# Altium project FIT_TCM.PrjPcb (part 6 of 9)

## Sheet FIT_FPGA_I-J-K.SchDoc: FIT_PM12 board
size 420 x 297 mm; CheckedBy: G.Kasprowicz; Author: INR Moscow; CompanyName: WUT ISE; DrawnBy: M.Podgórski; Organization: WUT ISE; Address1: PW ISE; Address2: Nowowiejska 15/19 00-665 Warsaw; Address3: gkasprow@gmail.com; Revision: 2; SheetNumber: -; SheetTotal: -; ModifiedBy: -; CheckedDate: -; Title2: Title 2; DivGrp: WUT ISE; Designer: INR RAS; ModifiedDate: -; ProjectName: Sensor Box
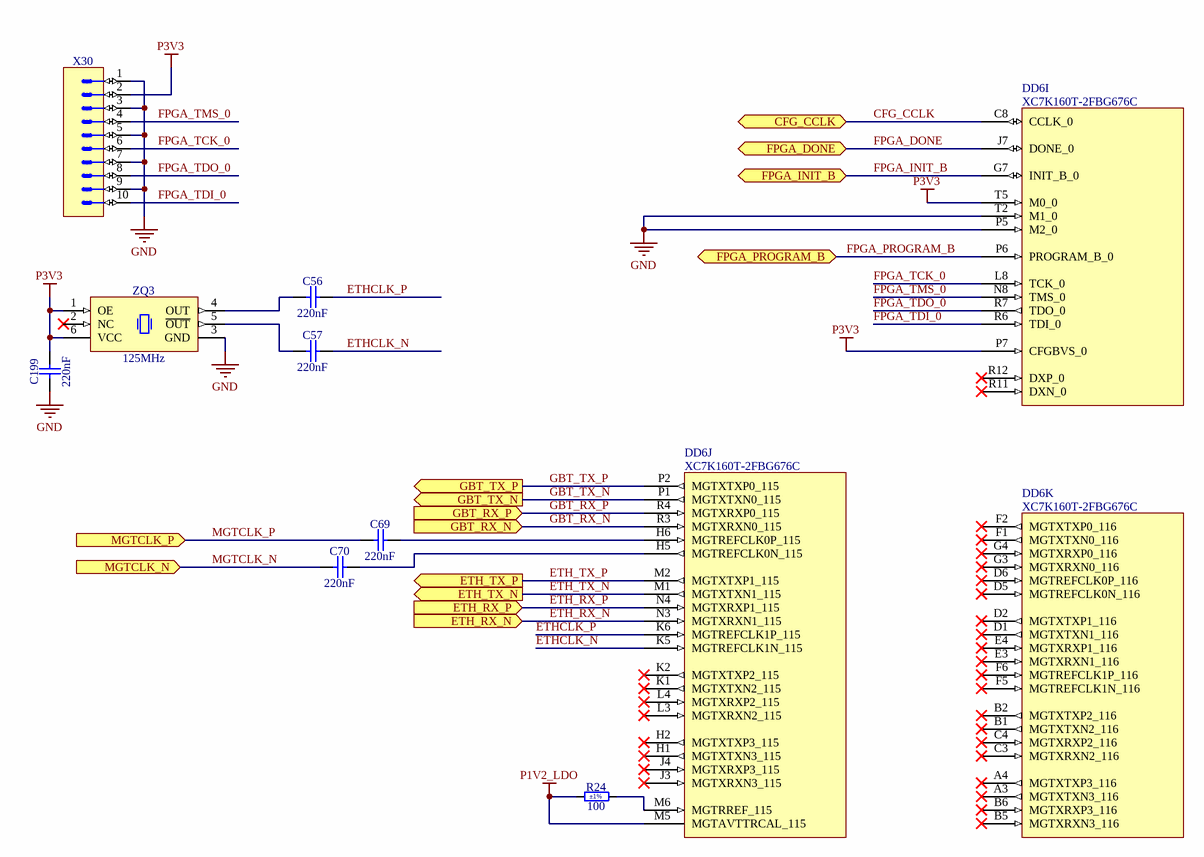
[diagram p18: FIT_FPGA_I-J-K.SchDoc]

### Parts
C56  220nF  [CAPC1608X87N]
C57  220nF  [CAPC1608X87N]
C69  220nF  [CAPC1608X87N]
C70  220nF  [CAPC1608X87N]
C199  220nF  [CAPC2012X135N]
DD6  XC7K160T-2FBG676C  [BGA676C100P26X26_2700X2700X254]  (parts I,J,K of 15)
R24  100  Tolerance: ±1%  [RESC1608X55N]
X30  (no value)  [CONNFLY_DS1014-10SF1B-B]
ZQ3  125MHz  [OSC_EPSON_SG5032VAN]

### Ports
CFG_CCLK (bidir), ETH_RX_N (in), ETH_RX_P (in), ETH_TX_N (out), ETH_TX_P (out), FPGA_DONE (bidir), FPGA_INIT_B (bidir), FPGA_PROGRAM_B (bidir), GBT_RX_N (in), GBT_RX_P (in), GBT_TX_N (out), GBT_TX_P (out), MGTCLK_N (in), MGTCLK_P (in)

### Nets
GND: C199.1 DD6.P5(M2_0) DD6.T2(M1_0) X30.1 X30.3 X30.5 X30.7 X30.9 ZQ3.3(GND)
P1V2_LDO: DD6.M5(MGTAVTTRCAL_115) R24.1
P3V3: C199.2 DD6.P7(CFGBVS_0) DD6.T5(M0_0) X30.2 ZQ3.1(OE) ZQ3.6(VCC)
CFG_CCLK: DD6.C8(CCLK_0) ; port CFG_CCLK
ETH_RX_N: DD6.N3(MGTXRXN1_115) ; port ETH_RX_N
ETH_RX_P: DD6.N4(MGTXRXP1_115) ; port ETH_RX_P
ETH_TX_N: DD6.M1(MGTXTXN1_115) ; port ETH_TX_N
ETH_TX_P: DD6.M2(MGTXTXP1_115) ; port ETH_TX_P
ETHCLK_N: C57.2 DD6.K5(MGTREFCLK1N_115)
ETHCLK_P: C56.2 DD6.K6(MGTREFCLK1P_115)
FPGA_DONE: DD6.J7(DONE_0) ; port FPGA_DONE
FPGA_INIT_B: DD6.G7(INIT_B_0) ; port FPGA_INIT_B
FPGA_PROGRAM_B: DD6.P6(PROGRAM_B_0) ; port FPGA_PROGRAM_B
FPGA_TCK_0: DD6.L8(TCK_0) X30.6
FPGA_TDI_0: DD6.R6(TDI_0) X30.10
FPGA_TDO_0: DD6.R7(TDO_0) X30.8
FPGA_TMS_0: DD6.N8(TMS_0) X30.4
GBT_RX_N: DD6.R3(MGTXRXN0_115) ; port GBT_RX_N
GBT_RX_P: DD6.R4(MGTXRXP0_115) ; port GBT_RX_P
GBT_TX_N: DD6.P1(MGTXTXN0_115) ; port GBT_TX_N
GBT_TX_P: DD6.P2(MGTXTXP0_115) ; port GBT_TX_P
MGTCLK_N: C70.1 ; port MGTCLK_N
MGTCLK_P: C69.1 ; port MGTCLK_P
NetC56_1: C56.1 ZQ3.4(OUT)
NetC57_1: C57.1 ZQ3.5(~{OUT})
NetC69_2: C69.2 DD6.H6(MGTREFCLK0P_115)
NetC70_2: C70.2 DD6.H5(MGTREFCLK0N_115)
NetDD6_M6: DD6.M6(MGTRREF_115) R24.2

Not connected (* = marked no-connect by the designer): DD6 A3(MGTXTXN3_116)* A4(MGTXTXP3_116)* B1(MGTXTXN2_116)* B2(MGTXTXP2_116)* B5(MGTXRXN3_116)* B6(MGTXRXP3_116)* C3(MGTXRXN2_116)* C4(MGTXRXP2_116)* D1(MGTXTXN1_116)* D2(MGTXTXP1_116)* D5(MGTREFCLK0N_116)* D6(MGTREFCLK0P_116)* E3(MGTXRXN1_116)* E4(MGTXRXP1_116)* F1(MGTXTXN0_116)* F2(MGTXTXP0_116)* F5(MGTREFCLK1N_116)* F6(MGTREFCLK1P_116)* G3(MGTXRXN0_116)* G4(MGTXRXP0_116)* H1(MGTXTXN3_115)* H2(MGTXTXP3_115)* J3(MGTXRXN3_115)* J4(MGTXRXP3_115)* K1(MGTXTXN2_115)* K2(MGTXTXP2_115)* L3(MGTXRXN2_115)* L4(MGTXRXP2_115)* R11(DXN_0)* R12(DXP_0)*; ZQ3 2(NC)*

### Notes on the sheet
- Project/Equipment
- Document
- Designer
- Drawn by
- Check.by
- Copyright WUT ISE 2024.
  This documentation describes Open Hardware and is licensed under the CERN OHL v.2. You may redistribute and modify this documentation under the terms of the CERN OHL v.2. (http://ohwr.org/CERNOHL). This documentation is distributed WITHOUT ANY EXPRESS OR IMPLIED WARRANTY, INCLUDING OF MERCHANTABILITY, SATISFACTORY QUALITY AND FITNESS FOR A PARTICULAR PURPOSE. Please see the CERN OHL v.2 for applicable conditions.
- Contact
- File
- Last Mod.
- Print Date
- Sheet
- Size
- A3
- of
- Rev

### Library data of the parts
C56 C57 C69 C70 = CC0603_220NF_25V_10%_X7R: Non-polarised capacitor; Part Description: SMD Multilayer Chip Ceramic Capacitor; Manufacturer: GENERIC; Manufacturer1 Part Number: C0603C224K3RACTU; Voltage: 25V; TC: X7R; Tolerance: ±10%; Part Number: CC0603_220NF_25V_10%_X7R; Component Kind: Standard; Component Type: Standard; Pin Count: 2; Value: 220nF; Status: Preferred; Manufacturer Part Number: CC0603_220NF_25V_10%_X7R; Case: 0603; Mounted: Yes; Socket: No; SMD: Yes; Sense: No; Manufacturer1 Example: KEMET; Manufacturer1 ComponentHeight: 0.87mm; HelpURL: \\cern.ch\dfs\Applications\Altium\Datasheets\CC0603_X7R_KEMET.pdf; Author: CERN DEM JLC; CreateDate: 29.10.2014; LatestRevisionDate: 29.10.2014
C199 = CC0805_220NF_50V_10%_X7R: Non-polarised capacitor; Part Description: SMD Multilayer Chip Ceramic Capacitor; Manufacturer: GENERIC; Manufacturer1 Part Number: GRM21BR71H224KA01L; Voltage: 50V; TC: X7R; Tolerance: ±10%; Part Number: CC0805_220NF_50V_10%_X7R; Component Kind: Standard; Component Type: Standard; Pin Count: 2; Value: 220nF; Status: Preferred; Manufacturer Part Number: CC0805_220NF_50V_10%_X7R; Case: 0805; Mounted: Yes; Socket: No; SMD: Yes; Sense: No; Manufacturer1 Example: MURATA; Manufacturer1 ComponentHeight: 1.35mm; HelpURL: \\cern.ch\dfs\Applications\Altium\Datasheets\CC0805_X7R_MURATA.pdf; Author: CERN DEM JLC; CreateDate: 03.12.2007; LatestRevisionDate: 03.12.2007
DD6 = XC7K160T-2FBG676C: as DD6 on sheet FIT_FPGA_E_G-H; Part Number: XC7K160T-2FBG676C; Component Kind: Standard; Component Type: Standard; Device: XC7K160T-2FBG676C; PackageDescription: BGA, 1.00mm Pitch, Square; 676 Pin, 26 Columns X 26 Rows, Body 27.0mm X 27.0mm X 2.54mm H, IPC Medium Density; Manufacturer Part Number: XC7K160T-2FBG676C; Pin Count: 676; Case: BGA676; Mounted: Yes; Socket: No; SMD: Yes; Sense: No; ComponentHeight: 2.54mm; HelpURL: \\cern.ch\dfs\Applications\Altium\Datasheets\XC7K160T-xFBG676C.pdf; ComponentLink1URL: \\cern.ch\dfs\Applications\Altium\Datasheets\XC7K160T-xFBG676C_Package-Pinout.pdf; ComponentLink1Description: Package/Pinout; Author: CERN DEM BC; CreateDate: 06.02.2020; LatestRevisionDate: 06.02.2020
R24 = R0603_100R_1%_0.1W_100PPM: Resistor - 1%; Part Description: General Purpose Thick Film Chip Resistor; Manufacturer: GENERIC; Manufacturer1 Part Number: NRC06F4700TRF; Power: 0.1W; TC: ±100ppm/°C; PressFit: No; Part Number: R0603_100R_1%_0.1W_100PPM; Component Kind: Standard; Component Type: Standard; Pin Count: 2; Value: 100; Status: Preferred; Manufacturer Part Number: R0603_100R_1%_0.1W_100PPM; Case: 0603; Mounted: Yes; Sense: No; Socket: No; SMD: Yes; Manufacturer1 Example: NIC COMPONENT; Manufacturer1 ComponentHeight: 0.55mm; HelpURL: \\cern.ch\dfs\Applications\Altium\Datasheets\R0603_NIC_NRC.pdf; Author: CERN DEM JLC; CreateDate: 03.12.2007; LatestRevisionDate: 13.03.2008
X30 = CONNFLY_DS1014-10SF1B-B: Connector 10 Male; Part Description: 10 Contacts, 2.00mm Box Header V/T,R/A & SMT Type; PressFit: No; Part Number: CONNFLY_DS1014-10SF1B-B; Component Kind: Standard; Component Type: Standard; Pin Count: 10; Mounted: Yes; Socket: No; SMD: No; Sense: No; Status: None; Manufacturer: CONNFLY; Manufacturer Part Number: DS1014-10SF1B-B; ComponentHeight: 5.6mm; HelpURL: \\cern.ch\dfs\Applications\Altium\Datasheets\CONNFLY_DS1014-10SF1B-B.pdf; Author: CERN DEM HF; CreateDate: 29.05.2024; LatestRevisionDate: 29.05.2024
ZQ3 = OSC_125MHZ_EPSON_X1G0042610020: Low-Jitter Saw Oscillator (EG-2102 Serie); Part Description: 3.3V, ±30ppm, -40°C to +85°C, LVDS XO Oscillator, SG5032VAN Series; Manufacturer: EPSON; PressFit: No; Bonding: No; Part Number: OSC_125MHZ_EPSON_X1G0042610020; Component Kind: Standard; Component Type: Standard; PackageDescription: SMD Oscillator, Side Concave; 1.27mm Pitch; 6 Pins, 3.2mm L X 5.0mm W X 1.20mm H; Value: 125MHz; Manufacturer Part Number: X1G0042610020; Pin Count: 6; Mounted: Yes; Socket: No; SMD: Yes; Sense: No; ComponentHeight: 1.2mm; HelpURL: \\cern.ch\dfs\Applications\Altium\Datasheets\OSC_EPSON_X1G004261.pdf; Author: CERN DEM HF; CreateDate: 11.06.2024; LatestRevisionDate: 11.06.2024

## Sheet FIT_FPGA_POWER.SchDoc: FIT_PM12 board
size 420 x 297 mm; CheckedBy: G.Kasprowicz; Author: INR Moscow; CompanyName: WUT ISE; DrawnBy: M.Podgórski; Organization: WUT ISE; Address1: PW ISE; Address2: Nowowiejska 15/19 00-665 Warsaw; Address3: gkasprow@gmail.com; Revision: 2; SheetNumber: -; SheetTotal: -; ModifiedBy: -; CheckedDate: -; Title2: Title 2; DivGrp: WUT ISE; Designer: INR RAS; ModifiedDate: -; ProjectName: Sensor Box
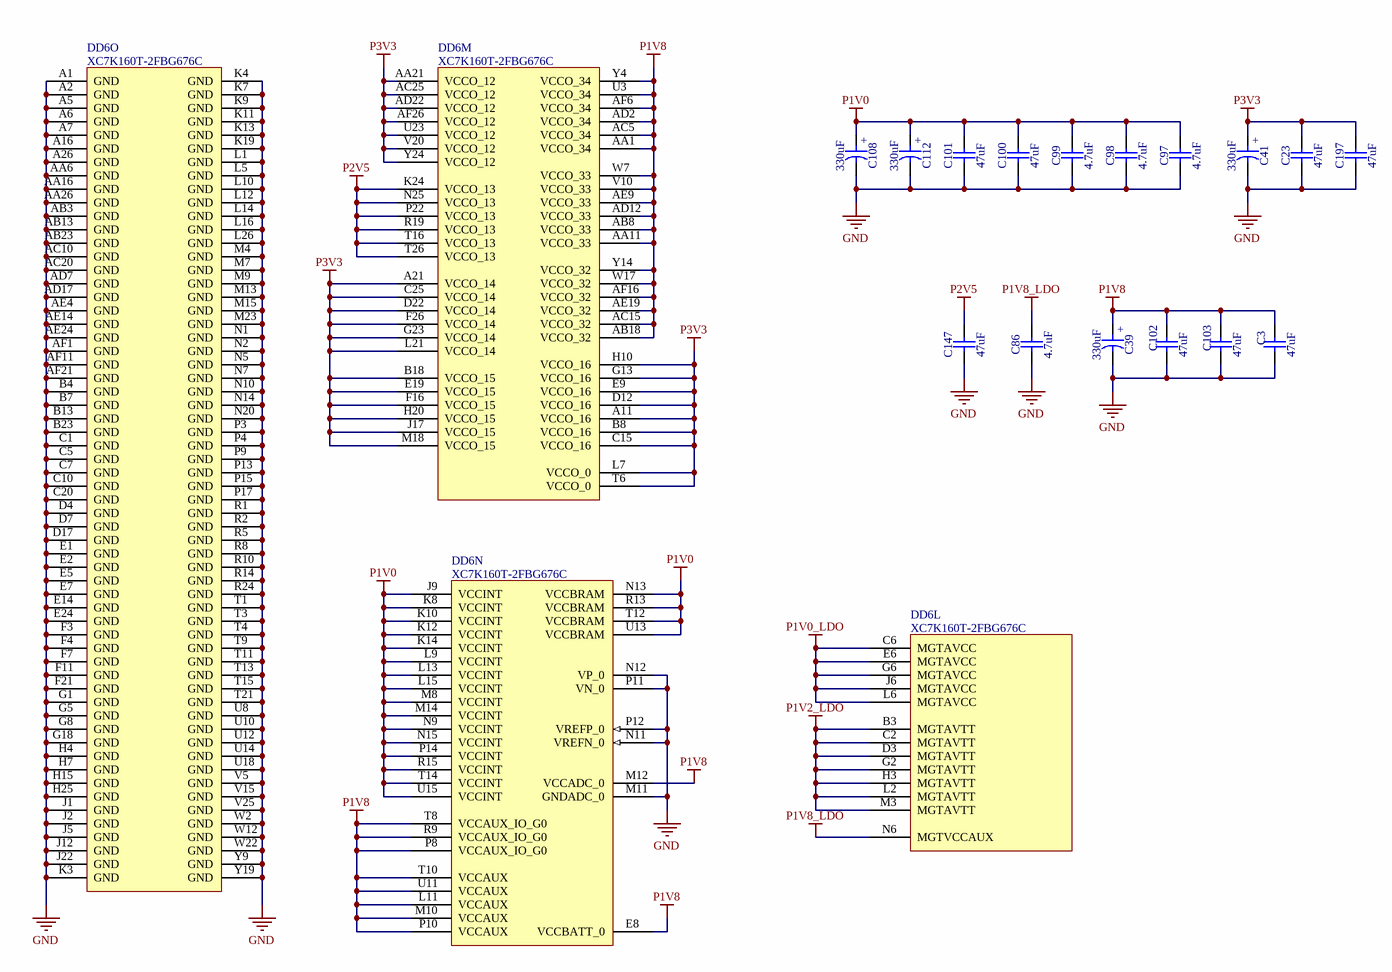
[diagram p19: FIT_FPGA_POWER.SchDoc]

### Parts
C3  47uF  [CAPC3225X270N]
C23  47uF  [CAPC3225X270N]
C39  330uF  [CAPMP7343X300N]
C41  330uF  [CAPMP7343X310N]
C86  4.7uF  [CAPC2012X145N]
C97  4.7uF  [CAPC2012X145N]
C98  4.7uF  [CAPC2012X145N]
C99  4.7uF  [CAPC2012X145N]
C100  47uF  [CAPC3225X270N]
C101  47uF  [CAPC3225X270N]
C102  47uF  [CAPC3225X270N]
C103  47uF  [CAPC3225X270N]
C108  330uF  [CAPMP7343X190N]
C112  330uF  [CAPMP7343X190N]
C147  47uF  [CAPC3225X270N]
C197  47uF  [CAPC3225X270N]
DD6  XC7K160T-2FBG676C  [BGA676C100P26X26_2700X2700X254]  (parts L,M,N,O of 15)

### Nets
GND: C3.1 C23.1 C39.2 C41.2 C86.1 C97.1 C98.1 C99.1 C100.1 C101.1 C102.1 C103.1 C108.2 C112.2 C147.1 C197.1 DD6.A1(GND) DD6.A2(GND) DD6.A5(GND) DD6.A6(GND) DD6.A7(GND) DD6.A16(GND) DD6.A26(GND) DD6.AA6(GND) DD6.AA16(GND) DD6.AA26(GND) DD6.AB3(GND) DD6.AB13(GND) DD6.AB23(GND) DD6.AC10(GND) DD6.AC20(GND) DD6.AD7(GND) DD6.AD17(GND) DD6.AE4(GND) DD6.AE14(GND) DD6.AE24(GND) DD6.AF1(GND) DD6.AF11(GND) DD6.AF21(GND) DD6.B4(GND) DD6.B7(GND) DD6.B13(GND) DD6.B23(GND) DD6.C1(GND) DD6.C5(GND) DD6.C7(GND) DD6.C10(GND) DD6.C20(GND) DD6.D4(GND) DD6.D7(GND) DD6.D17(GND) DD6.E1(GND) DD6.E2(GND) DD6.E5(GND) DD6.E7(GND) DD6.E14(GND) DD6.E24(GND) DD6.F3(GND) DD6.F4(GND) DD6.F7(GND) DD6.F11(GND) DD6.F21(GND) DD6.G1(GND) DD6.G5(GND) DD6.G8(GND) DD6.G18(GND) DD6.H4(GND) DD6.H7(GND) DD6.H15(GND) DD6.H25(GND) DD6.J1(GND) DD6.J2(GND) DD6.J5(GND) DD6.J12(GND) DD6.J22(GND) DD6.K3(GND) DD6.K4(GND) DD6.K7(GND) DD6.K9(GND) DD6.K11(GND) DD6.K13(GND) DD6.K19(GND) DD6.L1(GND) DD6.L5(GND) DD6.L10(GND) DD6.L12(GND) DD6.L14(GND) DD6.L16(GND) DD6.L26(GND) DD6.M4(GND) DD6.M7(GND) DD6.M9(GND) DD6.M11(GNDADC_0) DD6.M13(GND) DD6.M15(GND) DD6.M23(GND) DD6.N1(GND) DD6.N2(GND) DD6.N5(GND) DD6.N7(GND) DD6.N10(GND) DD6.N11(VREFN_0) DD6.N12(VP_0) DD6.N14(GND) DD6.N20(GND) DD6.P3(GND) DD6.P4(GND) DD6.P9(GND) DD6.P11(VN_0) DD6.P12(VREFP_0) DD6.P13(GND) DD6.P15(GND) DD6.P17(GND) DD6.R1(GND) DD6.R2(GND) DD6.R5(GND) DD6.R8(GND) DD6.R10(GND) DD6.R14(GND) DD6.R24(GND) DD6.T1(GND) DD6.T3(GND) DD6.T4(GND) DD6.T9(GND) DD6.T11(GND) DD6.T13(GND) DD6.T15(GND) DD6.T21(GND) DD6.U8(GND) DD6.U10(GND) DD6.U12(GND) DD6.U14(GND) DD6.U18(GND) DD6.V5(GND) DD6.V15(GND) DD6.V25(GND) DD6.W2(GND) DD6.W12(GND) DD6.W22(GND) DD6.Y9(GND) DD6.Y19(GND)
P1V0: C97.2 C98.2 C99.2 C100.2 C101.2 C108.1 C112.1 DD6.J9(VCCINT) DD6.K8(VCCINT) DD6.K10(VCCINT) DD6.K12(VCCINT) DD6.K14(VCCINT) DD6.L9(VCCINT) DD6.L13(VCCINT) DD6.L15(VCCINT) DD6.M8(VCCINT) DD6.M14(VCCINT) DD6.N9(VCCINT) DD6.N13(VCCBRAM) DD6.N15(VCCINT) DD6.P14(VCCINT) DD6.R13(VCCBRAM) DD6.R15(VCCINT) DD6.T12(VCCBRAM) DD6.T14(VCCINT) DD6.U13(VCCBRAM) DD6.U15(VCCINT)
P1V0_LDO: DD6.C6(MGTAVCC) DD6.E6(MGTAVCC) DD6.G6(MGTAVCC) DD6.J6(MGTAVCC) DD6.L6(MGTAVCC)
P1V2_LDO: DD6.B3(MGTAVTT) DD6.C2(MGTAVTT) DD6.D3(MGTAVTT) DD6.G2(MGTAVTT) DD6.H3(MGTAVTT) DD6.L2(MGTAVTT) DD6.M3(MGTAVTT)
P1V8: C3.2 C39.1 C102.2 C103.2 DD6.AA1(VCCO_34) DD6.AA11(VCCO_33) DD6.AB8(VCCO_33) DD6.AB18(VCCO_32) DD6.AC5(VCCO_34) DD6.AC15(VCCO_32) DD6.AD2(VCCO_34) DD6.AD12(VCCO_33) DD6.AE9(VCCO_33) DD6.AE19(VCCO_32) DD6.AF6(VCCO_34) DD6.AF16(VCCO_32) DD6.E8(VCCBATT_0) DD6.L11(VCCAUX) DD6.M10(VCCAUX) DD6.M12(VCCADC_0) DD6.P8(VCCAUX_IO_G0) DD6.P10(VCCAUX) DD6.R9(VCCAUX_IO_G0) DD6.T8(VCCAUX_IO_G0) DD6.T10(VCCAUX) DD6.U3(VCCO_34) DD6.U11(VCCAUX) DD6.V10(VCCO_33) DD6.W7(VCCO_33) DD6.W17(VCCO_32) DD6.Y4(VCCO_34) DD6.Y14(VCCO_32)
P1V8_LDO: C86.2 DD6.N6(MGTVCCAUX)
P2V5: C147.2 DD6.K24(VCCO_13) DD6.N25(VCCO_13) DD6.P22(VCCO_13) DD6.R19(VCCO_13) DD6.T16(VCCO_13) DD6.T26(VCCO_13)
P3V3: C23.2 C41.1 C197.2 DD6.A11(VCCO_16) DD6.A21(VCCO_14) DD6.AA21(VCCO_12) DD6.AC25(VCCO_12) DD6.AD22(VCCO_12) DD6.AF26(VCCO_12) DD6.B8(VCCO_16) DD6.B18(VCCO_15) DD6.C15(VCCO_16) DD6.C25(VCCO_14) DD6.D12(VCCO_16) DD6.D22(VCCO_14) DD6.E9(VCCO_16) DD6.E19(VCCO_15) DD6.F16(VCCO_15) DD6.F26(VCCO_14) DD6.G13(VCCO_16) DD6.G23(VCCO_14) DD6.H10(VCCO_16) DD6.H20(VCCO_15) DD6.J17(VCCO_15) DD6.L7(VCCO_0) DD6.L21(VCCO_14) DD6.M18(VCCO_15) DD6.T6(VCCO_0) DD6.U23(VCCO_12) DD6.V20(VCCO_12) DD6.Y24(VCCO_12)

### Notes on the sheet
- Project/Equipment
- Document
- Designer
- Drawn by
- Check.by
- Copyright WUT ISE 2024.
  This documentation describes Open Hardware and is licensed under the CERN OHL v.2. You may redistribute and modify this documentation under the terms of the CERN OHL v.2. (http://ohwr.org/CERNOHL). This documentation is distributed WITHOUT ANY EXPRESS OR IMPLIED WARRANTY, INCLUDING OF MERCHANTABILITY, SATISFACTORY QUALITY AND FITNESS FOR A PARTICULAR PURPOSE. Please see the CERN OHL v.2 for applicable conditions.
- Contact
- File
- Last Mod.
- Print Date
- Sheet
- Size
- A3
- of
- Rev
- (in symbol CTE7343-19_330UF_2.5V_20%_LESR0009_KEMET_T520) +
- (in symbol CTE7343-30_330UF_4V_20%_PANASONIC_TPF) +
- (in symbol CTE7343-31_330UF_6.3V_20%_LESR0015_KEMET_T520) +

### Library data of the parts
C3 C23 C100-C103 C147 C197 = CC1210_47UF_16V_20%_X5R: Non-polarised capacitor; Part Description: SMD Multilayer Chip Ceramic Capacitor; Manufacturer: GENERIC; Manufacturer1 Part Number: EMK325BJ476MM-T; Voltage: 16V; TC: X5R; Tolerance: ±20%; Part Number: CC1210_47UF_16V_20%_X5R; Component Kind: Standard; Component Type: Standard; Pin Count: 2; Value: 47uF; Status: None; Manufacturer Part Number: CC1210_47UF_16V_20%_X5R; Case: 1210; Mounted: Yes; Socket: No; SMD: Yes; Sense: No; Manufacturer1 Example: TAIYO YUDEN; Manufacturer1 ComponentHeight: 2.7mm; HelpURL: \\cern.ch\dfs\Applications\Altium\Datasheets\CC1210_X5R_TAIYO-YUDEN_HIGH-VALUE.pdf; Author: CERN DEM MR; CreateDate: 03.02.2016; LatestRevisionDate: 03.02.2016
C39 = CTE7343-30_330UF_4V_20%_PANASONIC_TPF: Polarised capacitor; Part Description: ESR 0R009 Tantalum Chip Capacitor; Manufacturer Part Number: 4TPF330M9L; Voltage: 4V; Tolerance: ±20%; Part Number: CTE7343-30_330UF_4V_20%_PANASONIC_TPF; Component Kind: Standard; Component Type: Standard; Pin Count: 2; Value: 330uF; Status: None; Manufacturer: PANASONIC; Mounted: Yes; Socket: No; SMD: Yes; Sense: No; ComponentHeight: 3mm; HelpURL: \\cern.ch\dfs\Applications\Altium\Datasheets\CTE_PANASONIC_TPF.pdf; Author: CERN DEM HF; CreateDate: 30.05.2024; LatestRevisionDate: 30.05.2024
C41 = CTE7343-31_330UF_6.3V_20%_LESR0015_KEMET_T520: Polarised capacitor; Part Description: Low ESR 0R015 Tantalum Chip Capacitor; Manufacturer: KEMET; Manufacturer Part Number: T520D337M006ATE015; Voltage: 6.3V; Tolerance: ±20%; Part Number: CTE7343-31_330UF_6.3V_20%_LESR0015_KEMET_T520; Component Kind: Standard; Component Type: Standard; Pin Count: 2; Value: 330uF; Status: None; Case: D; Mounted: Yes; Socket: No; SMD: Yes; Sense: No; ComponentHeight: 3.1mm; HelpURL: \\cern.ch\dfs\Applications\Altium\Datasheets\CTE-LESR_KEMET_T520.pdf; Author: CERN DEM JLC; CreateDate: 11.01.2012; LatestRevisionDate: 11.01.2012
C86 C97-C99 = CC0805_4.7UF_50V_10%_X7R: Non-polarised capacitor; Part Description: SMD Multilayer Chip Ceramic Capacitor; Manufacturer: GENERIC; Manufacturer1 Part Number: C2012X7R1H475K125; Voltage: 50V; TC: X7R; Tolerance: ±10%; Part Number: CC0805_4.7UF_50V_10%_X7R; Component Kind: Standard; Component Type: Standard; Pin Count: 2; Value: 4.7uF; Status: Preferred; Manufacturer Part Number: CC0805_4.7UF_50V_10%_X7R; Case: 0805; Mounted: Yes; Socket: No; SMD: Yes; Sense: No; Manufacturer1 Example: TDK; Manufacturer1 ComponentHeight: 1.45mm; HelpURL: \\cern.ch\dfs\Applications\Altium\Datasheets\CC0805_X7R_TDK_C.pdf; Author: CERN DEM JMW; CreateDate: 30.07.2021; LatestRevisionDate: 30.07.2021
C108 C112 = CTE7343-19_330UF_2.5V_20%_LESR0009_KEMET_T520: Polarised capacitor; Part Description: Low ESR 0R009 Tantalum Chip Capacitor; Manufacturer: KEMET; Manufacturer Part Number: T520V337M2R5ATE009; Voltage: 2.5V; Tolerance: ±20%; Part Number: CTE7343-19_330UF_2.5V_20%_LESR0009_KEMET_T520; Component Kind: Standard; Component Type: Standard; Pin Count: 2; Value: 330uF; Status: None; Case: V; Mounted: Yes; Socket: No; SMD: Yes; Sense: No; ComponentHeight: 1.9mm; HelpURL: \\cern.ch\dfs\Applications\Altium\Datasheets\CTE-LESR_KEMET_T520.pdf; Author: CERN DEM HF; CreateDate: 30.05.2024; LatestRevisionDate: 30.05.2024
DD6 = XC7K160T-2FBG676C: as DD6 on sheet FIT_FPGA_E_G-H; Part Number: XC7K160T-2FBG676C; Component Kind: Standard; Component Type: Standard; Device: XC7K160T-2FBG676C; PackageDescription: BGA, 1.00mm Pitch, Square; 676 Pin, 26 Columns X 26 Rows, Body 27.0mm X 27.0mm X 2.54mm H, IPC Medium Density; Manufacturer Part Number: XC7K160T-2FBG676C; Pin Count: 676; Case: BGA676; Mounted: Yes; Socket: No; SMD: Yes; Sense: No; ComponentHeight: 2.54mm; HelpURL: \\cern.ch\dfs\Applications\Altium\Datasheets\XC7K160T-xFBG676C.pdf; ComponentLink1URL: \\cern.ch\dfs\Applications\Altium\Datasheets\XC7K160T-xFBG676C_Package-Pinout.pdf; ComponentLink1Description: Package/Pinout; Author: CERN DEM BC; CreateDate: 06.02.2020; LatestRevisionDate: 06.02.2020

## Sheet FIT_FPGA_B-F.SchDoc: FIT_PM12 board
size 420 x 297 mm; CheckedBy: G.Kasprowicz; Author: INR Moscow; CompanyName: WUT ISE; DrawnBy: M.Podgórski; Organization: WUT ISE; Address1: PW ISE; Address2: Nowowiejska 15/19 00-665 Warsaw; Address3: gkasprow@gmail.com; Revision: 2; SheetNumber: -; SheetTotal: -; ModifiedBy: -; CheckedDate: -; Title2: Title 2; DivGrp: WUT ISE; Designer: INR RAS; ModifiedDate: -; ProjectName: Sensor Box
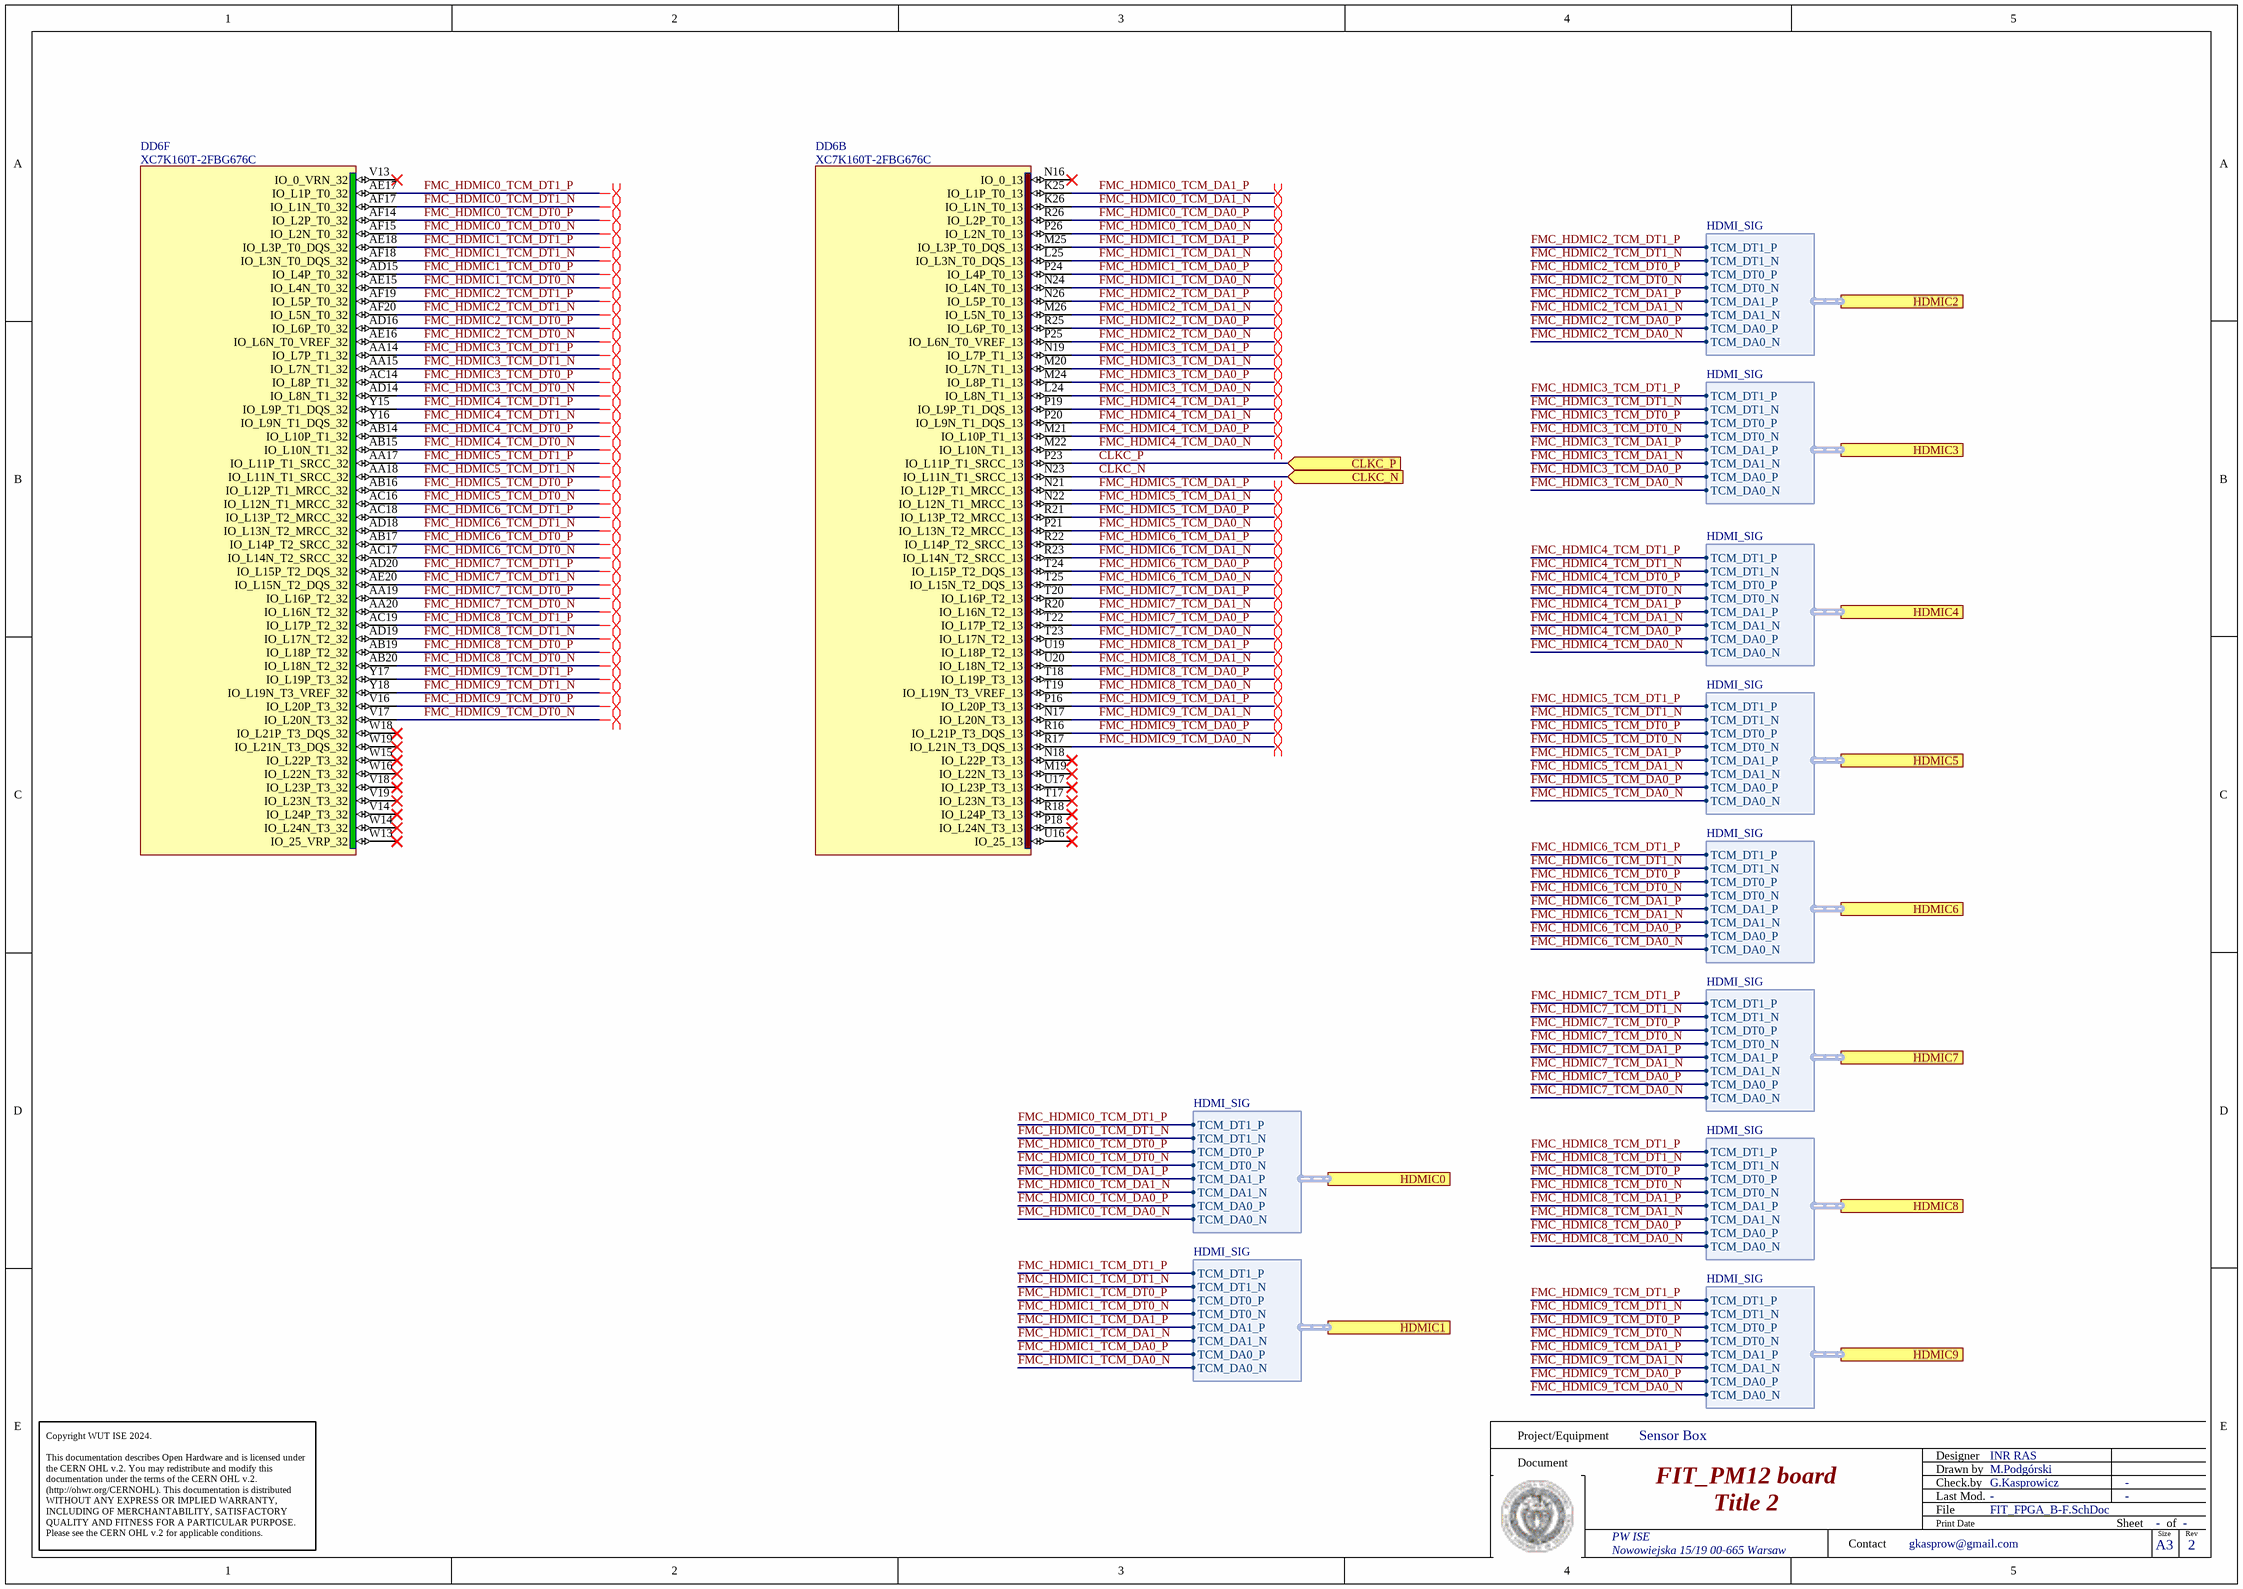
[diagram p20: FIT_FPGA_B-F.SchDoc]

### Parts
DD6  XC7K160T-2FBG676C  [BGA676C100P26X26_2700X2700X254]  (parts B,F of 15)

### Ports
CLKC_N (in), CLKC_P (in), HDMIC0 (harness HDMI_SIG), HDMIC1 (harness HDMI_SIG), HDMIC2 (harness HDMI_SIG), HDMIC3 (harness HDMI_SIG), HDMIC4 (harness HDMI_SIG), HDMIC5 (harness HDMI_SIG), HDMIC6 (harness HDMI_SIG), HDMIC7 (harness HDMI_SIG), HDMIC8 (harness HDMI_SIG), HDMIC9 (harness HDMI_SIG)

### Harnesses
HDMI_SIG: TCM_DT1_P, TCM_DT1_N, TCM_DT0_P, TCM_DT0_N, TCM_DA1_P, TCM_DA1_N, TCM_DA0_P, TCM_DA0_N

### Nets
CLKC_N: DD6.N23(IO_L11N_T1_SRCC_13) ; port CLKC_N
CLKC_P: DD6.P23(IO_L11P_T1_SRCC_13) ; port CLKC_P
FMC_HDMIC0_TCM_DA0_N: DD6.P26(IO_L2N_T0_13) ; port HDMIC0.TCM_DA0_N  [project net HDMIC0.TCM_DA0_N]
FMC_HDMIC0_TCM_DA0_P: DD6.R26(IO_L2P_T0_13) ; port HDMIC0.TCM_DA0_P  [project net HDMIC0.TCM_DA0_P]
FMC_HDMIC0_TCM_DA1_N: DD6.K26(IO_L1N_T0_13) ; port HDMIC0.TCM_DA1_N  [project net HDMIC0.TCM_DA1_N]
FMC_HDMIC0_TCM_DA1_P: DD6.K25(IO_L1P_T0_13) ; port HDMIC0.TCM_DA1_P  [project net HDMIC0.TCM_DA1_P]
FMC_HDMIC0_TCM_DT0_N: DD6.AF15(IO_L2N_T0_32) ; port HDMIC0.TCM_DT0_N  [project net HDMIC0.TCM_DT0_N]
FMC_HDMIC0_TCM_DT0_P: DD6.AF14(IO_L2P_T0_32) ; port HDMIC0.TCM_DT0_P  [project net HDMIC0.TCM_DT0_P]
FMC_HDMIC0_TCM_DT1_N: DD6.AF17(IO_L1N_T0_32) ; port HDMIC0.TCM_DT1_N  [project net HDMIC0.TCM_DT1_N]
FMC_HDMIC0_TCM_DT1_P: DD6.AE17(IO_L1P_T0_32) ; port HDMIC0.TCM_DT1_P  [project net HDMIC0.TCM_DT1_P]
FMC_HDMIC1_TCM_DA0_N: DD6.N24(IO_L4N_T0_13) ; port HDMIC1.TCM_DA0_N  [project net HDMIC1.TCM_DA0_N]
FMC_HDMIC1_TCM_DA0_P: DD6.P24(IO_L4P_T0_13) ; port HDMIC1.TCM_DA0_P  [project net HDMIC1.TCM_DA0_P]
FMC_HDMIC1_TCM_DA1_N: DD6.L25(IO_L3N_T0_DQS_13) ; port HDMIC1.TCM_DA1_N  [project net HDMIC1.TCM_DA1_N]
FMC_HDMIC1_TCM_DA1_P: DD6.M25(IO_L3P_T0_DQS_13) ; port HDMIC1.TCM_DA1_P  [project net HDMIC1.TCM_DA1_P]
FMC_HDMIC1_TCM_DT0_N: DD6.AE15(IO_L4N_T0_32) ; port HDMIC1.TCM_DT0_N  [project net HDMIC1.TCM_DT0_N]
FMC_HDMIC1_TCM_DT0_P: DD6.AD15(IO_L4P_T0_32) ; port HDMIC1.TCM_DT0_P  [project net HDMIC1.TCM_DT0_P]
FMC_HDMIC1_TCM_DT1_N: DD6.AF18(IO_L3N_T0_DQS_32) ; port HDMIC1.TCM_DT1_N  [project net HDMIC1.TCM_DT1_N]
FMC_HDMIC1_TCM_DT1_P: DD6.AE18(IO_L3P_T0_DQS_32) ; port HDMIC1.TCM_DT1_P  [project net HDMIC1.TCM_DT1_P]
FMC_HDMIC2_TCM_DA0_N: DD6.P25(IO_L6N_T0_VREF_13) ; port HDMIC2.TCM_DA0_N  [project net HDMIC2.TCM_DA0_N]
FMC_HDMIC2_TCM_DA0_P: DD6.R25(IO_L6P_T0_13) ; port HDMIC2.TCM_DA0_P  [project net HDMIC2.TCM_DA0_P]
FMC_HDMIC2_TCM_DA1_N: DD6.M26(IO_L5N_T0_13) ; port HDMIC2.TCM_DA1_N  [project net HDMIC2.TCM_DA1_N]
FMC_HDMIC2_TCM_DA1_P: DD6.N26(IO_L5P_T0_13) ; port HDMIC2.TCM_DA1_P  [project net HDMIC2.TCM_DA1_P]
FMC_HDMIC2_TCM_DT0_N: DD6.AE16(IO_L6N_T0_VREF_32) ; port HDMIC2.TCM_DT0_N  [project net HDMIC2.TCM_DT0_N]
FMC_HDMIC2_TCM_DT0_P: DD6.AD16(IO_L6P_T0_32) ; port HDMIC2.TCM_DT0_P  [project net HDMIC2.TCM_DT0_P]
FMC_HDMIC2_TCM_DT1_N: DD6.AF20(IO_L5N_T0_32) ; port HDMIC2.TCM_DT1_N  [project net HDMIC2.TCM_DT1_N]
FMC_HDMIC2_TCM_DT1_P: DD6.AF19(IO_L5P_T0_32) ; port HDMIC2.TCM_DT1_P  [project net HDMIC2.TCM_DT1_P]
FMC_HDMIC3_TCM_DA0_N: DD6.L24(IO_L8N_T1_13) ; port HDMIC3.TCM_DA0_N  [project net HDMIC3.TCM_DA0_N]
FMC_HDMIC3_TCM_DA0_P: DD6.M24(IO_L8P_T1_13) ; port HDMIC3.TCM_DA0_P  [project net HDMIC3.TCM_DA0_P]
FMC_HDMIC3_TCM_DA1_N: DD6.M20(IO_L7N_T1_13) ; port HDMIC3.TCM_DA1_N  [project net HDMIC3.TCM_DA1_N]
FMC_HDMIC3_TCM_DA1_P: DD6.N19(IO_L7P_T1_13) ; port HDMIC3.TCM_DA1_P  [project net HDMIC3.TCM_DA1_P]
FMC_HDMIC3_TCM_DT0_N: DD6.AD14(IO_L8N_T1_32) ; port HDMIC3.TCM_DT0_N  [project net HDMIC3.TCM_DT0_N]
FMC_HDMIC3_TCM_DT0_P: DD6.AC14(IO_L8P_T1_32) ; port HDMIC3.TCM_DT0_P  [project net HDMIC3.TCM_DT0_P]
FMC_HDMIC3_TCM_DT1_N: DD6.AA15(IO_L7N_T1_32) ; port HDMIC3.TCM_DT1_N  [project net HDMIC3.TCM_DT1_N]
FMC_HDMIC3_TCM_DT1_P: DD6.AA14(IO_L7P_T1_32) ; port HDMIC3.TCM_DT1_P  [project net HDMIC3.TCM_DT1_P]
FMC_HDMIC4_TCM_DA0_N: DD6.M22(IO_L10N_T1_13) ; port HDMIC4.TCM_DA0_N  [project net HDMIC4.TCM_DA0_N]
FMC_HDMIC4_TCM_DA0_P: DD6.M21(IO_L10P_T1_13) ; port HDMIC4.TCM_DA0_P  [project net HDMIC4.TCM_DA0_P]
FMC_HDMIC4_TCM_DA1_N: DD6.P20(IO_L9N_T1_DQS_13) ; port HDMIC4.TCM_DA1_N  [project net HDMIC4.TCM_DA1_N]
FMC_HDMIC4_TCM_DA1_P: DD6.P19(IO_L9P_T1_DQS_13) ; port HDMIC4.TCM_DA1_P  [project net HDMIC4.TCM_DA1_P]
FMC_HDMIC4_TCM_DT0_N: DD6.AB15(IO_L10N_T1_32) ; port HDMIC4.TCM_DT0_N  [project net HDMIC4.TCM_DT0_N]
FMC_HDMIC4_TCM_DT0_P: DD6.AB14(IO_L10P_T1_32) ; port HDMIC4.TCM_DT0_P  [project net HDMIC4.TCM_DT0_P]
FMC_HDMIC4_TCM_DT1_N: DD6.Y16(IO_L9N_T1_DQS_32) ; port HDMIC4.TCM_DT1_N  [project net HDMIC4.TCM_DT1_N]
FMC_HDMIC4_TCM_DT1_P: DD6.Y15(IO_L9P_T1_DQS_32) ; port HDMIC4.TCM_DT1_P  [project net HDMIC4.TCM_DT1_P]
FMC_HDMIC5_TCM_DA0_N: DD6.P21(IO_L13N_T2_MRCC_13) ; port HDMIC5.TCM_DA0_N  [project net HDMIC5.TCM_DA0_N]
FMC_HDMIC5_TCM_DA0_P: DD6.R21(IO_L13P_T2_MRCC_13) ; port HDMIC5.TCM_DA0_P  [project net HDMIC5.TCM_DA0_P]
FMC_HDMIC5_TCM_DA1_N: DD6.N22(IO_L12N_T1_MRCC_13) ; port HDMIC5.TCM_DA1_N  [project net HDMIC5.TCM_DA1_N]
FMC_HDMIC5_TCM_DA1_P: DD6.N21(IO_L12P_T1_MRCC_13) ; port HDMIC5.TCM_DA1_P  [project net HDMIC5.TCM_DA1_P]
FMC_HDMIC5_TCM_DT0_N: DD6.AC16(IO_L12N_T1_MRCC_32) ; port HDMIC5.TCM_DT0_N  [project net HDMIC5.TCM_DT0_N]
FMC_HDMIC5_TCM_DT0_P: DD6.AB16(IO_L12P_T1_MRCC_32) ; port HDMIC5.TCM_DT0_P  [project net HDMIC5.TCM_DT0_P]
FMC_HDMIC5_TCM_DT1_N: DD6.AA18(IO_L11N_T1_SRCC_32) ; port HDMIC5.TCM_DT1_N  [project net HDMIC5.TCM_DT1_N]
FMC_HDMIC5_TCM_DT1_P: DD6.AA17(IO_L11P_T1_SRCC_32) ; port HDMIC5.TCM_DT1_P  [project net HDMIC5.TCM_DT1_P]
FMC_HDMIC6_TCM_DA0_N: DD6.T25(IO_L15N_T2_DQS_13) ; port HDMIC6.TCM_DA0_N  [project net HDMIC6.TCM_DA0_N]
FMC_HDMIC6_TCM_DA0_P: DD6.T24(IO_L15P_T2_DQS_13) ; port HDMIC6.TCM_DA0_P  [project net HDMIC6.TCM_DA0_P]
FMC_HDMIC6_TCM_DA1_N: DD6.R23(IO_L14N_T2_SRCC_13) ; port HDMIC6.TCM_DA1_N  [project net HDMIC6.TCM_DA1_N]
FMC_HDMIC6_TCM_DA1_P: DD6.R22(IO_L14P_T2_SRCC_13) ; port HDMIC6.TCM_DA1_P  [project net HDMIC6.TCM_DA1_P]
FMC_HDMIC6_TCM_DT0_N: DD6.AC17(IO_L14N_T2_SRCC_32) ; port HDMIC6.TCM_DT0_N  [project net HDMIC6.TCM_DT0_N]
FMC_HDMIC6_TCM_DT0_P: DD6.AB17(IO_L14P_T2_SRCC_32) ; port HDMIC6.TCM_DT0_P  [project net HDMIC6.TCM_DT0_P]
FMC_HDMIC6_TCM_DT1_N: DD6.AD18(IO_L13N_T2_MRCC_32) ; port HDMIC6.TCM_DT1_N  [project net HDMIC6.TCM_DT1_N]
FMC_HDMIC6_TCM_DT1_P: DD6.AC18(IO_L13P_T2_MRCC_32) ; port HDMIC6.TCM_DT1_P  [project net HDMIC6.TCM_DT1_P]
FMC_HDMIC7_TCM_DA0_N: DD6.T23(IO_L17N_T2_13) ; port HDMIC7.TCM_DA0_N  [project net HDMIC7.TCM_DA0_N]
FMC_HDMIC7_TCM_DA0_P: DD6.T22(IO_L17P_T2_13) ; port HDMIC7.TCM_DA0_P  [project net HDMIC7.TCM_DA0_P]
FMC_HDMIC7_TCM_DA1_N: DD6.R20(IO_L16N_T2_13) ; port HDMIC7.TCM_DA1_N  [project net HDMIC7.TCM_DA1_N]
FMC_HDMIC7_TCM_DA1_P: DD6.T20(IO_L16P_T2_13) ; port HDMIC7.TCM_DA1_P  [project net HDMIC7.TCM_DA1_P]
FMC_HDMIC7_TCM_DT0_N: DD6.AA20(IO_L16N_T2_32) ; port HDMIC7.TCM_DT0_N  [project net HDMIC7.TCM_DT0_N]
FMC_HDMIC7_TCM_DT0_P: DD6.AA19(IO_L16P_T2_32) ; port HDMIC7.TCM_DT0_P  [project net HDMIC7.TCM_DT0_P]
FMC_HDMIC7_TCM_DT1_N: DD6.AE20(IO_L15N_T2_DQS_32) ; port HDMIC7.TCM_DT1_N  [project net HDMIC7.TCM_DT1_N]
FMC_HDMIC7_TCM_DT1_P: DD6.AD20(IO_L15P_T2_DQS_32) ; port HDMIC7.TCM_DT1_P  [project net HDMIC7.TCM_DT1_P]
FMC_HDMIC8_TCM_DA0_N: DD6.T19(IO_L19N_T3_VREF_13) ; port HDMIC8.TCM_DA0_N  [project net HDMIC8.TCM_DA0_N]
FMC_HDMIC8_TCM_DA0_P: DD6.T18(IO_L19P_T3_13) ; port HDMIC8.TCM_DA0_P  [project net HDMIC8.TCM_DA0_P]
FMC_HDMIC8_TCM_DA1_N: DD6.U20(IO_L18N_T2_13) ; port HDMIC8.TCM_DA1_N  [project net HDMIC8.TCM_DA1_N]
FMC_HDMIC8_TCM_DA1_P: DD6.U19(IO_L18P_T2_13) ; port HDMIC8.TCM_DA1_P  [project net HDMIC8.TCM_DA1_P]
FMC_HDMIC8_TCM_DT0_N: DD6.AB20(IO_L18N_T2_32) ; port HDMIC8.TCM_DT0_N  [project net HDMIC8.TCM_DT0_N]
FMC_HDMIC8_TCM_DT0_P: DD6.AB19(IO_L18P_T2_32) ; port HDMIC8.TCM_DT0_P  [project net HDMIC8.TCM_DT0_P]
FMC_HDMIC8_TCM_DT1_N: DD6.AD19(IO_L17N_T2_32) ; port HDMIC8.TCM_DT1_N  [project net HDMIC8.TCM_DT1_N]
FMC_HDMIC8_TCM_DT1_P: DD6.AC19(IO_L17P_T2_32) ; port HDMIC8.TCM_DT1_P  [project net HDMIC8.TCM_DT1_P]
FMC_HDMIC9_TCM_DA0_N: DD6.R17(IO_L21N_T3_DQS_13) ; port HDMIC9.TCM_DA0_N  [project net HDMIC9.TCM_DA0_N]
FMC_HDMIC9_TCM_DA0_P: DD6.R16(IO_L21P_T3_DQS_13) ; port HDMIC9.TCM_DA0_P  [project net HDMIC9.TCM_DA0_P]
FMC_HDMIC9_TCM_DA1_N: DD6.N17(IO_L20N_T3_13) ; port HDMIC9.TCM_DA1_N  [project net HDMIC9.TCM_DA1_N]
FMC_HDMIC9_TCM_DA1_P: DD6.P16(IO_L20P_T3_13) ; port HDMIC9.TCM_DA1_P  [project net HDMIC9.TCM_DA1_P]
FMC_HDMIC9_TCM_DT0_N: DD6.V17(IO_L20N_T3_32) ; port HDMIC9.TCM_DT0_N  [project net HDMIC9.TCM_DT0_N]
FMC_HDMIC9_TCM_DT0_P: DD6.V16(IO_L20P_T3_32) ; port HDMIC9.TCM_DT0_P  [project net HDMIC9.TCM_DT0_P]
FMC_HDMIC9_TCM_DT1_N: DD6.Y18(IO_L19N_T3_VREF_32) ; port HDMIC9.TCM_DT1_N  [project net HDMIC9.TCM_DT1_N]
FMC_HDMIC9_TCM_DT1_P: DD6.Y17(IO_L19P_T3_32) ; port HDMIC9.TCM_DT1_P  [project net HDMIC9.TCM_DT1_P]

Not connected (* = marked no-connect by the designer): DD6 M19(IO_L22N_T3_13)* N16(IO_0_13)* N18(IO_L22P_T3_13)* P18(IO_L24N_T3_13)* R18(IO_L24P_T3_13)* T17(IO_L23N_T3_13)* U16(IO_25_13)* U17(IO_L23P_T3_13)* V13(IO_0_VRN_32)* V14(IO_L24P_T3_32)* V18(IO_L23P_T3_32)* V19(IO_L23N_T3_32)* W13(IO_25_VRP_32)* W14(IO_L24N_T3_32)* W15(IO_L22P_T3_32)* W16(IO_L22N_T3_32)* W18(IO_L21P_T3_DQS_32)* W19(IO_L21N_T3_DQS_32)*

### Layout directives
differential pair: HDMIC0.TCM_DA0_N, HDMIC0.TCM_DA0_P, HDMIC0.TCM_DA1_N, HDMIC0.TCM_DA1_P, HDMIC0.TCM_DT0_N, HDMIC0.TCM_DT0_P, HDMIC0.TCM_DT1_N, HDMIC0.TCM_DT1_P, HDMIC1.TCM_DA0_N, HDMIC1.TCM_DA0_P, HDMIC1.TCM_DA1_N, HDMIC1.TCM_DA1_P, HDMIC1.TCM_DT0_N, HDMIC1.TCM_DT0_P, HDMIC1.TCM_DT1_N, HDMIC1.TCM_DT1_P, HDMIC2.TCM_DA0_N, HDMIC2.TCM_DA0_P, HDMIC2.TCM_DA1_N, HDMIC2.TCM_DA1_P, HDMIC2.TCM_DT0_N, HDMIC2.TCM_DT0_P, HDMIC2.TCM_DT1_N, HDMIC2.TCM_DT1_P, HDMIC3.TCM_DA0_N, HDMIC3.TCM_DA0_P, HDMIC3.TCM_DA1_N, HDMIC3.TCM_DA1_P, HDMIC3.TCM_DT0_N, HDMIC3.TCM_DT0_P, HDMIC3.TCM_DT1_N, HDMIC3.TCM_DT1_P, HDMIC4.TCM_DA0_N, HDMIC4.TCM_DA0_P, HDMIC4.TCM_DA1_N, HDMIC4.TCM_DA1_P, HDMIC4.TCM_DT0_N, HDMIC4.TCM_DT0_P, HDMIC4.TCM_DT1_N, HDMIC4.TCM_DT1_P, HDMIC5.TCM_DA0_N, HDMIC5.TCM_DA0_P, HDMIC5.TCM_DA1_N, HDMIC5.TCM_DA1_P, HDMIC5.TCM_DT0_N, HDMIC5.TCM_DT0_P, HDMIC5.TCM_DT1_N, HDMIC5.TCM_DT1_P, HDMIC6.TCM_DA0_N, HDMIC6.TCM_DA0_P, HDMIC6.TCM_DA1_N, HDMIC6.TCM_DA1_P, HDMIC6.TCM_DT0_N, HDMIC6.TCM_DT0_P, HDMIC6.TCM_DT1_N, HDMIC6.TCM_DT1_P, HDMIC7.TCM_DA0_N, HDMIC7.TCM_DA0_P, HDMIC7.TCM_DA1_N, HDMIC7.TCM_DA1_P, HDMIC7.TCM_DT0_N, HDMIC7.TCM_DT0_P, HDMIC7.TCM_DT1_N, HDMIC7.TCM_DT1_P, HDMIC8.TCM_DA0_N, HDMIC8.TCM_DA0_P, HDMIC8.TCM_DA1_N, HDMIC8.TCM_DA1_P, HDMIC8.TCM_DT0_N, HDMIC8.TCM_DT0_P, HDMIC8.TCM_DT1_N, HDMIC8.TCM_DT1_P, HDMIC9.TCM_DA0_N, HDMIC9.TCM_DA0_P, HDMIC9.TCM_DA1_N, HDMIC9.TCM_DA1_P, HDMIC9.TCM_DT0_N, HDMIC9.TCM_DT0_P, HDMIC9.TCM_DT1_N, HDMIC9.TCM_DT1_P

### Notes on the sheet
- Project/Equipment
- Document
- Designer
- Drawn by
- Check.by
- Copyright WUT ISE 2024.
  This documentation describes Open Hardware and is licensed under the CERN OHL v.2. You may redistribute and modify this documentation under the terms of the CERN OHL v.2. (http://ohwr.org/CERNOHL). This documentation is distributed WITHOUT ANY EXPRESS OR IMPLIED WARRANTY, INCLUDING OF MERCHANTABILITY, SATISFACTORY QUALITY AND FITNESS FOR A PARTICULAR PURPOSE. Please see the CERN OHL v.2 for applicable conditions.
- Contact
- File
- Last Mod.
- Print Date
- Sheet
- Size
- A3
- of
- Rev

### Library data of the parts
DD6 = XC7K160T-2FBG676C: KINTEX-7, FPGA, 676-Ball BGA, Pb-Free; Part Description: KINTEX-7 FPGA, 162240 Logic Cells, 400 User I/O, 8 GTXs, 676-Ball BGA, Speed Grade 2, Commercial Grade, Pb-Free; Manufacturer: XILINX; PressFit: No; Bonding: No; Part Number: XC7K160T-2FBG676C; Component Kind: Standard; Component Type: Standard; Device: XC7K160T-2FBG676C; PackageDescription: BGA, 1.00mm Pitch, Square; 676 Pin, 26 Columns X 26 Rows, Body 27.0mm X 27.0mm X 2.54mm H, IPC Medium Density; Manufacturer Part Number: XC7K160T-2FBG676C; Pin Count: 676; Case: BGA676; Mounted: Yes; Socket: No; SMD: Yes; Sense: No; ComponentHeight: 2.54mm; HelpURL: \\cern.ch\dfs\Applications\Altium\Datasheets\XC7K160T-xFBG676C.pdf; ComponentLink1URL: \\cern.ch\dfs\Applications\Altium\Datasheets\XC7K160T-xFBG676C_Package-Pinout.pdf; ComponentLink1Description: Package/Pinout; Author: CERN DEM BC; CreateDate: 06.02.2020; LatestRevisionDate: 06.02.2020

## Sheet FIT_TCM_HDMI.SchDoc: FIT_TCM board
size 420 x 297 mm; CheckedBy: G.Kasprowicz; Author: INR Moscow; CompanyName: WUT ISE; DrawnBy: M.Podgórski; Organization: WUT ISE; Address1: PW ISE; Address2: Nowowiejska 15/19 00-665 Warsaw; Address3: gkasprow@gmail.com; DocumentNumber: 15; Revision: 2; SheetNumber: 22; SheetTotal: 32; ModifiedBy: -; CheckedDate: -; Title2: HDMI IN subsystem; DivGrp: WUT ISE; Designer: INR RAS; ModifiedDate: -; ProjectName: Sensor Box
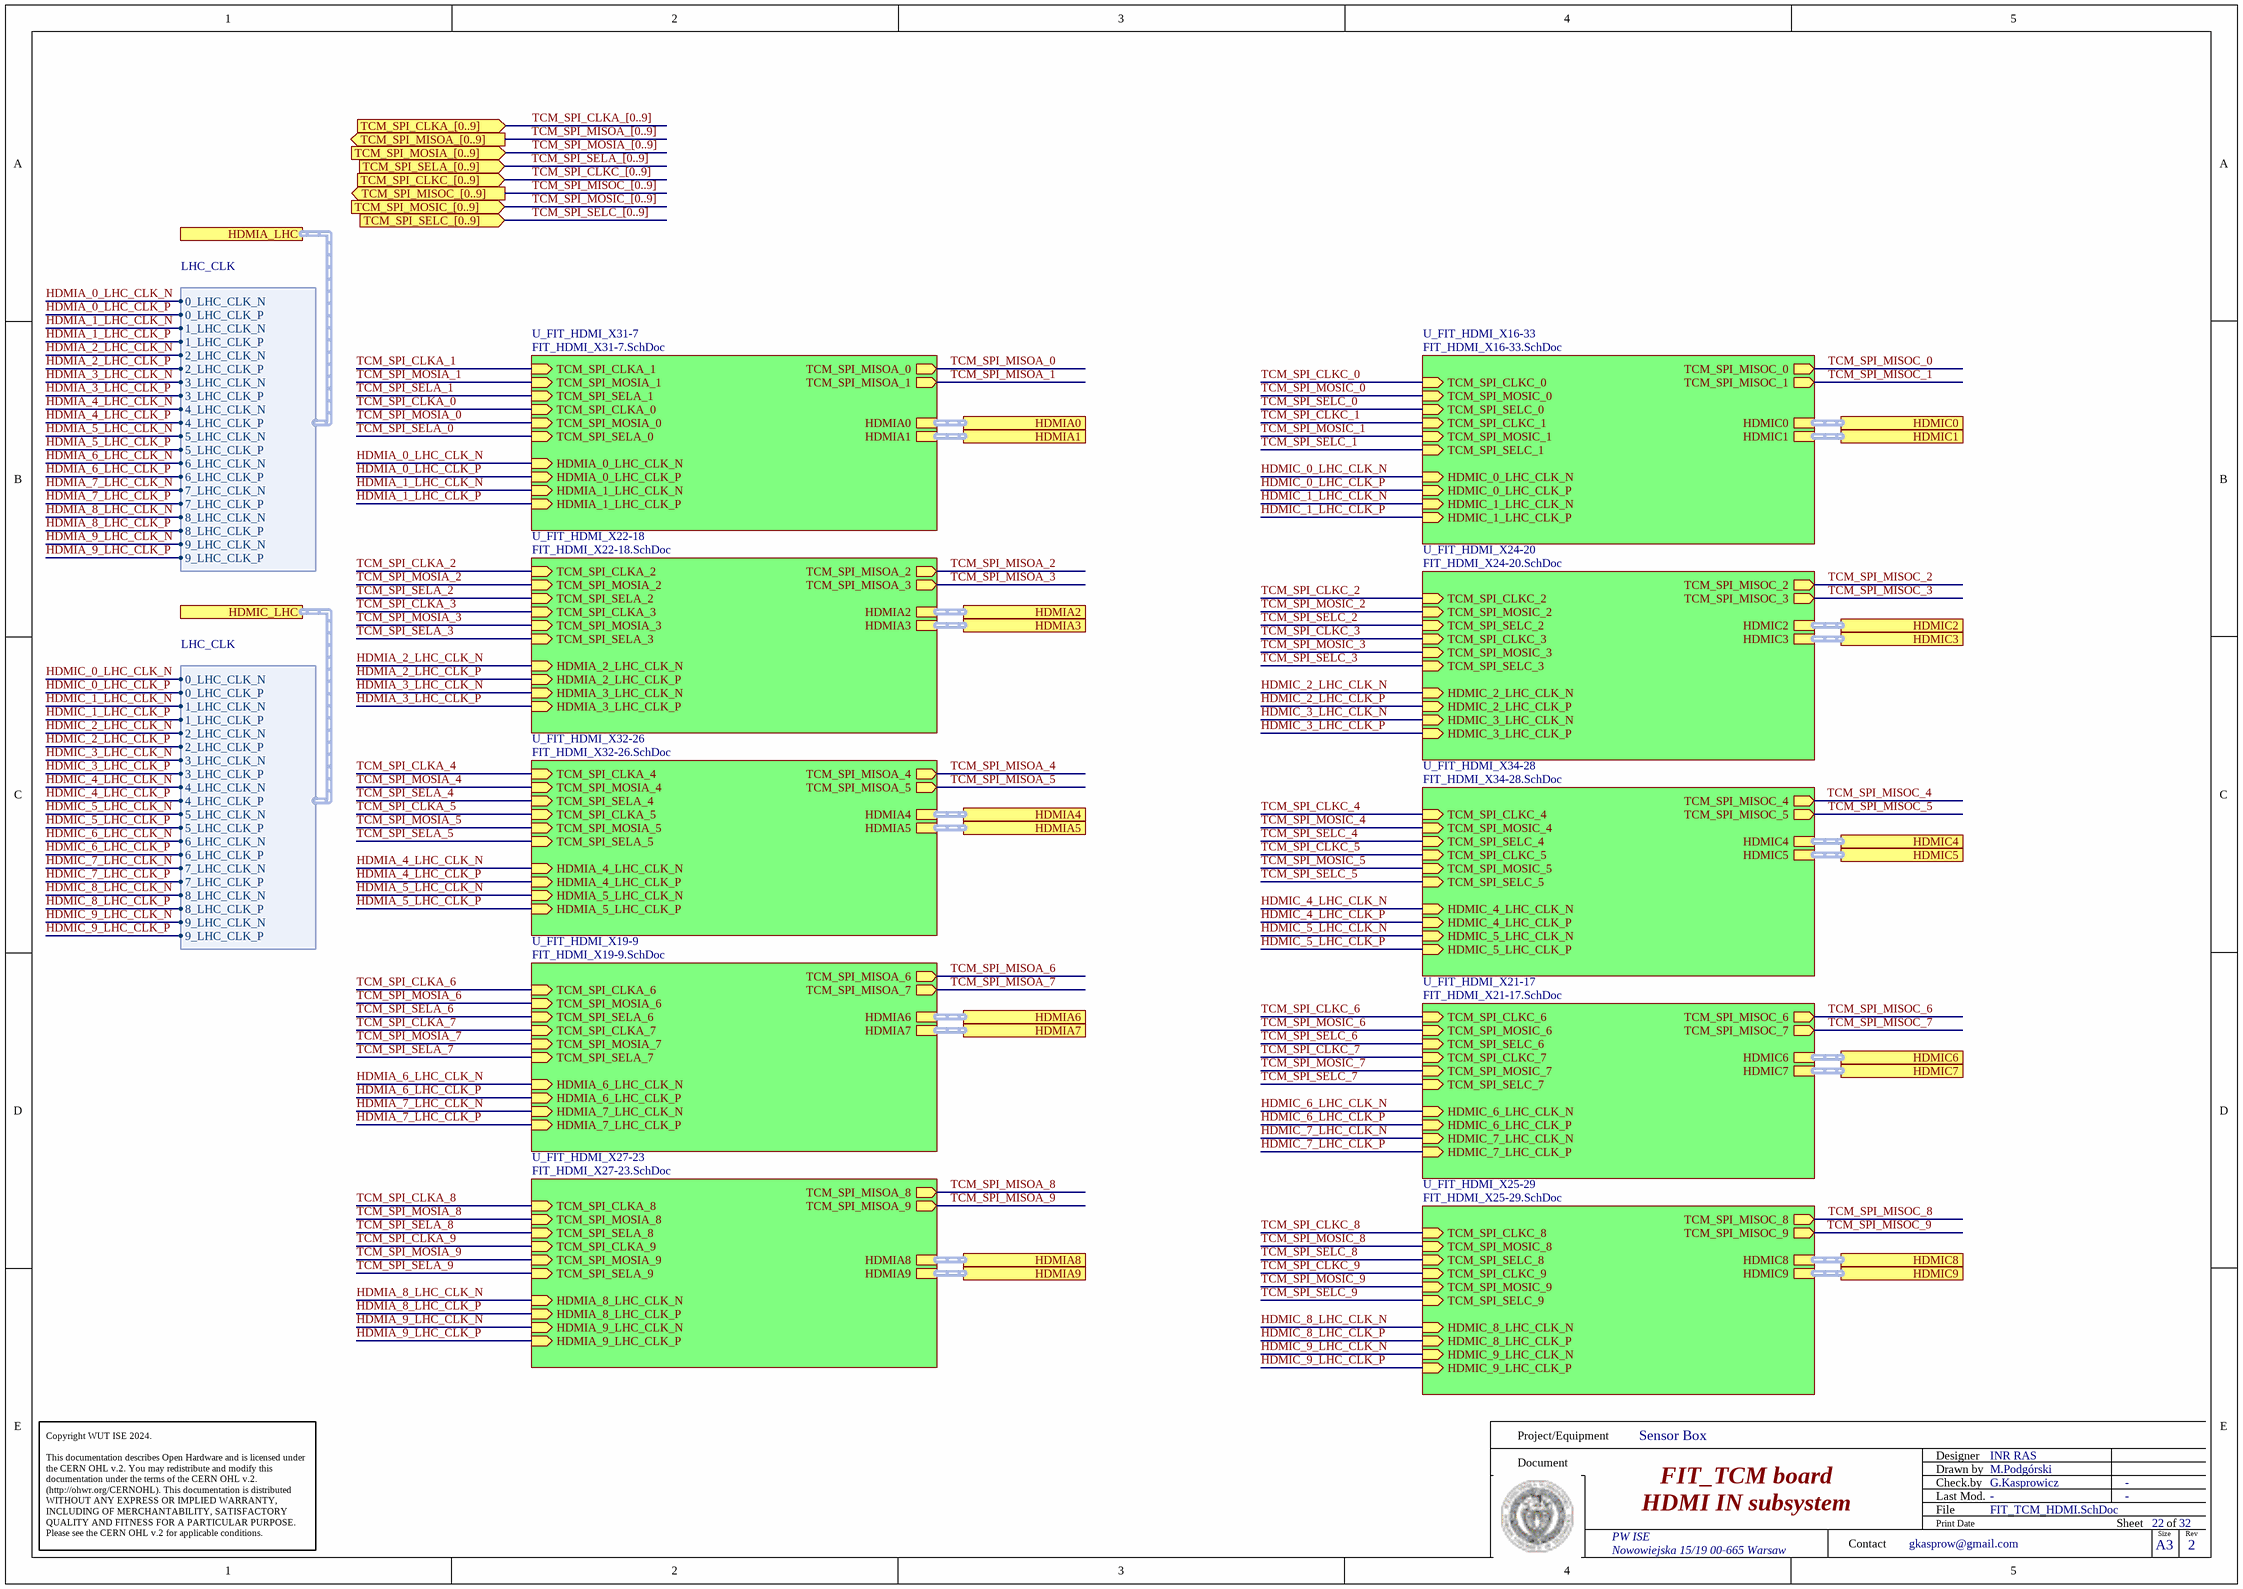
[diagram p21: FIT_TCM_HDMI.SchDoc]

### Sub-sheets
U_FIT_HDMI_X16-33 = FIT_HDMI_X16-33.SchDoc: HDMIC_0_LHC_CLK_P (in), HDMIC_0_LHC_CLK_N (in), HDMIC_1_LHC_CLK_P (in), HDMIC_1_LHC_CLK_N (in), TCM_SPI_SELC_0 (in), TCM_SPI_CLKC_0 (in), TCM_SPI_MOSIC_0 (in), TCM_SPI_MISOC_0 (out), TCM_SPI_SELC_1 (in), TCM_SPI_CLKC_1 (in), TCM_SPI_MOSIC_1 (in), TCM_SPI_MISOC_1 (out), HDMIC0 (harness HDMI_SIG), HDMIC1 (harness HDMI_SIG)
U_FIT_HDMI_X19-9 = FIT_HDMI_X19-9.SchDoc: HDMIA_7_LHC_CLK_P (in), HDMIA_7_LHC_CLK_N (in), HDMIA_6_LHC_CLK_P (in), HDMIA_6_LHC_CLK_N (in), TCM_SPI_SELA_7 (in), TCM_SPI_CLKA_7 (in), TCM_SPI_MOSIA_7 (in), TCM_SPI_MISOA_7 (out), TCM_SPI_SELA_6 (in), TCM_SPI_CLKA_6 (in), TCM_SPI_MOSIA_6 (in), TCM_SPI_MISOA_6 (out), HDMIA7 (harness HDMI_SIG), HDMIA6 (harness HDMI_SIG)
U_FIT_HDMI_X21-17 = FIT_HDMI_X21-17.SchDoc: HDMIC_6_LHC_CLK_P (in), HDMIC_6_LHC_CLK_N (in), HDMIC_7_LHC_CLK_P (in), HDMIC_7_LHC_CLK_N (in), TCM_SPI_SELC_6 (in), TCM_SPI_CLKC_6 (in), TCM_SPI_MOSIC_6 (in), TCM_SPI_MISOC_6 (out), TCM_SPI_SELC_7 (in), TCM_SPI_CLKC_7 (in), TCM_SPI_MOSIC_7 (in), TCM_SPI_MISOC_7 (out), HDMIC6 (harness HDMI_SIG), HDMIC7 (harness HDMI_SIG)
U_FIT_HDMI_X22-18 = FIT_HDMI_X22-18.SchDoc: HDMIA_2_LHC_CLK_P (in), HDMIA_2_LHC_CLK_N (in), HDMIA_3_LHC_CLK_P (in), HDMIA_3_LHC_CLK_N (in), TCM_SPI_MISOA_2 (out), TCM_SPI_MOSIA_2 (in), TCM_SPI_CLKA_2 (in), TCM_SPI_SELA_2 (in), TCM_SPI_SELA_3 (in), TCM_SPI_CLKA_3 (in), TCM_SPI_MOSIA_3 (in), TCM_SPI_MISOA_3 (out), HDMIA2 (harness HDMI_SIG), HDMIA3 (harness HDMI_SIG)
U_FIT_HDMI_X24-20 = FIT_HDMI_X24-20.SchDoc: HDMIC_2_LHC_CLK_P (in), HDMIC_2_LHC_CLK_N (in), HDMIC_3_LHC_CLK_P (in), HDMIC_3_LHC_CLK_N (in), TCM_SPI_SELC_2 (in), TCM_SPI_CLKC_2 (in), TCM_SPI_MOSIC_2 (in), TCM_SPI_MISOC_2 (out), TCM_SPI_SELC_3 (in), TCM_SPI_CLKC_3 (in), TCM_SPI_MOSIC_3 (in), TCM_SPI_MISOC_3 (out), HDMIC2 (harness HDMI_SIG), HDMIC3 (harness HDMI_SIG)
U_FIT_HDMI_X25-29 = FIT_HDMI_X25-29.SchDoc: HDMIC_8_LHC_CLK_P (in), HDMIC_8_LHC_CLK_N (in), TCM_SPI_SELC_8 (in), TCM_SPI_CLKC_8 (in), TCM_SPI_MOSIC_8 (in), TCM_SPI_MISOC_8 (out), HDMIC_9_LHC_CLK_P (in), HDMIC_9_LHC_CLK_N (in), TCM_SPI_SELC_9 (in), TCM_SPI_CLKC_9 (in), TCM_SPI_MOSIC_9 (in), TCM_SPI_MISOC_9 (out), HDMIC8 (harness HDMI_SIG), HDMIC9 (harness HDMI_SIG)
U_FIT_HDMI_X27-23 = FIT_HDMI_X27-23.SchDoc: HDMIA_8_LHC_CLK_P (in), HDMIA_8_LHC_CLK_N (in), HDMIA_9_LHC_CLK_P (in), HDMIA_9_LHC_CLK_N (in), TCM_SPI_SELA_8 (in), TCM_SPI_CLKA_8 (in), TCM_SPI_MOSIA_8 (in), TCM_SPI_MISOA_8 (out), TCM_SPI_SELA_9 (in), TCM_SPI_CLKA_9 (in), TCM_SPI_MOSIA_9 (in), TCM_SPI_MISOA_9 (out), HDMIA8 (harness HDMI_SIG), HDMIA9 (harness HDMI_SIG)
U_FIT_HDMI_X31-7 = FIT_HDMI_X31-7.SchDoc: HDMIA_1_LHC_CLK_P (in), HDMIA_1_LHC_CLK_N (in), HDMIA_0_LHC_CLK_P (in), HDMIA_0_LHC_CLK_N (in), TCM_SPI_CLKA_1 (in), TCM_SPI_SELA_1 (in), TCM_SPI_MOSIA_1 (in), TCM_SPI_MISOA_1 (out), TCM_SPI_MISOA_0 (out), TCM_SPI_MOSIA_0 (in), TCM_SPI_CLKA_0 (in), TCM_SPI_SELA_0 (in), HDMIA1 (harness HDMI_SIG), HDMIA0 (harness HDMI_SIG)
U_FIT_HDMI_X32-26 = FIT_HDMI_X32-26.SchDoc: HDMIA_5_LHC_CLK_P (in), HDMIA_5_LHC_CLK_N (in), HDMIA_4_LHC_CLK_P (in), HDMIA_4_LHC_CLK_N (in), TCM_SPI_SELA_4 (in), TCM_SPI_CLKA_4 (in), TCM_SPI_MOSIA_4 (in), TCM_SPI_MISOA_4 (out), TCM_SPI_SELA_5 (in), TCM_SPI_CLKA_5 (in), TCM_SPI_MOSIA_5 (in), TCM_SPI_MISOA_5 (out), HDMIA4 (harness HDMI_SIG), HDMIA5 (harness HDMI_SIG)
U_FIT_HDMI_X34-28 = FIT_HDMI_X34-28.SchDoc: HDMIC_5_LHC_CLK_P (in), HDMIC_5_LHC_CLK_N (in), HDMIC_4_LHC_CLK_P (in), HDMIC_4_LHC_CLK_N (in), TCM_SPI_SELC_5 (in), TCM_SPI_CLKC_5 (in), TCM_SPI_MOSIC_5 (in), TCM_SPI_MISOC_5 (out), TCM_SPI_SELC_4 (in), TCM_SPI_CLKC_4 (in), TCM_SPI_MOSIC_4 (in), TCM_SPI_MISOC_4 (out), HDMIC5 (harness HDMI_SIG), HDMIC4 (harness HDMI_SIG)

### Ports
HDMIA0 (harness HDMI_SIG), HDMIA1 (harness HDMI_SIG), HDMIA2 (harness HDMI_SIG), HDMIA3 (harness HDMI_SIG), HDMIA4 (harness HDMI_SIG), HDMIA5 (harness HDMI_SIG), HDMIA6 (harness HDMI_SIG), HDMIA7 (harness HDMI_SIG), HDMIA8 (harness HDMI_SIG), HDMIA9 (harness HDMI_SIG), HDMIA_LHC (harness LHC_CLK), HDMIC0 (harness HDMI_SIG), HDMIC1 (harness HDMI_SIG), HDMIC2 (harness HDMI_SIG), HDMIC3 (harness HDMI_SIG), HDMIC4 (harness HDMI_SIG), HDMIC5 (harness HDMI_SIG), HDMIC6 (harness HDMI_SIG), HDMIC7 (harness HDMI_SIG), HDMIC8 (harness HDMI_SIG), HDMIC9 (harness HDMI_SIG), HDMIC_LHC (harness LHC_CLK), TCM_SPI_CLKA_[0..9] (in), TCM_SPI_CLKC_[0..9] (in), TCM_SPI_MISOA_[0..9] (out), TCM_SPI_MISOC_[0..9] (out), TCM_SPI_MOSIA_[0..9] (in), TCM_SPI_MOSIC_[0..9] (in), TCM_SPI_SELA_[0..9] (in), TCM_SPI_SELC_[0..9] (in)

### Harnesses
LHC_CLK: 0_LHC_CLK_N, 0_LHC_CLK_P, 1_LHC_CLK_N, 1_LHC_CLK_P, 2_LHC_CLK_N, 2_LHC_CLK_P, 3_LHC_CLK_N, 4_LHC_CLK_N, 3_LHC_CLK_P, 4_LHC_CLK_P, 5_LHC_CLK_N, 5_LHC_CLK_P, 6_LHC_CLK_N, 6_LHC_CLK_P, 7_LHC_CLK_N, 7_LHC_CLK_P, 8_LHC_CLK_N, 8_LHC_CLK_P, 9_LHC_CLK_N, 9_LHC_CLK_P

### Nets
HDMIA_0_LHC_CLK_N: sheet U_FIT_HDMI_X31-7/HDMIA_0_LHC_CLK_N, port HDMIA_LHC.0_LHC_CLK_N  [project net HDMIA_LHC.0_LHC_CLK_N]
HDMIA_0_LHC_CLK_P: sheet U_FIT_HDMI_X31-7/HDMIA_0_LHC_CLK_P, port HDMIA_LHC.0_LHC_CLK_P  [project net HDMIA_LHC.0_LHC_CLK_P]
HDMIA_1_LHC_CLK_N: sheet U_FIT_HDMI_X31-7/HDMIA_1_LHC_CLK_N, port HDMIA_LHC.1_LHC_CLK_N  [project net HDMIA_LHC.1_LHC_CLK_N]
HDMIA_1_LHC_CLK_P: sheet U_FIT_HDMI_X31-7/HDMIA_1_LHC_CLK_P, port HDMIA_LHC.1_LHC_CLK_P  [project net HDMIA_LHC.1_LHC_CLK_P]
HDMIA_2_LHC_CLK_N: sheet U_FIT_HDMI_X22-18/HDMIA_2_LHC_CLK_N, port HDMIA_LHC.2_LHC_CLK_N  [project net HDMIA_LHC.2_LHC_CLK_N]
HDMIA_2_LHC_CLK_P: sheet U_FIT_HDMI_X22-18/HDMIA_2_LHC_CLK_P, port HDMIA_LHC.2_LHC_CLK_P  [project net HDMIA_LHC.2_LHC_CLK_P]
HDMIA_3_LHC_CLK_N: sheet U_FIT_HDMI_X22-18/HDMIA_3_LHC_CLK_N, port HDMIA_LHC.3_LHC_CLK_N  [project net HDMIA_LHC.3_LHC_CLK_N]
HDMIA_3_LHC_CLK_P: sheet U_FIT_HDMI_X22-18/HDMIA_3_LHC_CLK_P, port HDMIA_LHC.3_LHC_CLK_P  [project net HDMIA_LHC.3_LHC_CLK_P]
HDMIA_4_LHC_CLK_N: sheet U_FIT_HDMI_X32-26/HDMIA_4_LHC_CLK_N, port HDMIA_LHC.4_LHC_CLK_N  [project net HDMIA_LHC.4_LHC_CLK_N]
HDMIA_4_LHC_CLK_P: sheet U_FIT_HDMI_X32-26/HDMIA_4_LHC_CLK_P, port HDMIA_LHC.4_LHC_CLK_P  [project net HDMIA_LHC.4_LHC_CLK_P]
HDMIA_5_LHC_CLK_N: sheet U_FIT_HDMI_X32-26/HDMIA_5_LHC_CLK_N, port HDMIA_LHC.5_LHC_CLK_N  [project net HDMIA_LHC.5_LHC_CLK_N]
HDMIA_5_LHC_CLK_P: sheet U_FIT_HDMI_X32-26/HDMIA_5_LHC_CLK_P, port HDMIA_LHC.5_LHC_CLK_P  [project net HDMIA_LHC.5_LHC_CLK_P]
HDMIA_6_LHC_CLK_N: sheet U_FIT_HDMI_X19-9/HDMIA_6_LHC_CLK_N, port HDMIA_LHC.6_LHC_CLK_N  [project net HDMIA_LHC.6_LHC_CLK_N]
HDMIA_6_LHC_CLK_P: sheet U_FIT_HDMI_X19-9/HDMIA_6_LHC_CLK_P, port HDMIA_LHC.6_LHC_CLK_P  [project net HDMIA_LHC.6_LHC_CLK_P]
HDMIA_7_LHC_CLK_N: sheet U_FIT_HDMI_X19-9/HDMIA_7_LHC_CLK_N, port HDMIA_LHC.7_LHC_CLK_N  [project net HDMIA_LHC.7_LHC_CLK_N]
HDMIA_7_LHC_CLK_P: sheet U_FIT_HDMI_X19-9/HDMIA_7_LHC_CLK_P, port HDMIA_LHC.7_LHC_CLK_P  [project net HDMIA_LHC.7_LHC_CLK_P]
HDMIA_8_LHC_CLK_N: sheet U_FIT_HDMI_X27-23/HDMIA_8_LHC_CLK_N, port HDMIA_LHC.8_LHC_CLK_N  [project net HDMIA_LHC.8_LHC_CLK_N]
HDMIA_8_LHC_CLK_P: sheet U_FIT_HDMI_X27-23/HDMIA_8_LHC_CLK_P, port HDMIA_LHC.8_LHC_CLK_P  [project net HDMIA_LHC.8_LHC_CLK_P]
HDMIA_9_LHC_CLK_N: sheet U_FIT_HDMI_X27-23/HDMIA_9_LHC_CLK_N, port HDMIA_LHC.9_LHC_CLK_N  [project net HDMIA_LHC.9_LHC_CLK_N]
HDMIA_9_LHC_CLK_P: sheet U_FIT_HDMI_X27-23/HDMIA_9_LHC_CLK_P, port HDMIA_LHC.9_LHC_CLK_P  [project net HDMIA_LHC.9_LHC_CLK_P]
HDMIC_0_LHC_CLK_N: sheet U_FIT_HDMI_X16-33/HDMIC_0_LHC_CLK_N, port HDMIC_LHC.0_LHC_CLK_N  [project net HDMIC_LHC.0_LHC_CLK_N]
HDMIC_0_LHC_CLK_P: sheet U_FIT_HDMI_X16-33/HDMIC_0_LHC_CLK_P, port HDMIC_LHC.0_LHC_CLK_P  [project net HDMIC_LHC.0_LHC_CLK_P]
HDMIC_1_LHC_CLK_N: sheet U_FIT_HDMI_X16-33/HDMIC_1_LHC_CLK_N, port HDMIC_LHC.1_LHC_CLK_N  [project net HDMIC_LHC.1_LHC_CLK_N]
HDMIC_1_LHC_CLK_P: sheet U_FIT_HDMI_X16-33/HDMIC_1_LHC_CLK_P, port HDMIC_LHC.1_LHC_CLK_P  [project net HDMIC_LHC.1_LHC_CLK_P]
HDMIC_2_LHC_CLK_N: sheet U_FIT_HDMI_X24-20/HDMIC_2_LHC_CLK_N, port HDMIC_LHC.2_LHC_CLK_N  [project net HDMIC_LHC.2_LHC_CLK_N]
HDMIC_2_LHC_CLK_P: sheet U_FIT_HDMI_X24-20/HDMIC_2_LHC_CLK_P, port HDMIC_LHC.2_LHC_CLK_P  [project net HDMIC_LHC.2_LHC_CLK_P]
HDMIC_3_LHC_CLK_N: sheet U_FIT_HDMI_X24-20/HDMIC_3_LHC_CLK_N, port HDMIC_LHC.3_LHC_CLK_N  [project net HDMIC_LHC.3_LHC_CLK_N]
HDMIC_3_LHC_CLK_P: sheet U_FIT_HDMI_X24-20/HDMIC_3_LHC_CLK_P, port HDMIC_LHC.3_LHC_CLK_P  [project net HDMIC_LHC.3_LHC_CLK_P]
HDMIC_4_LHC_CLK_N: sheet U_FIT_HDMI_X34-28/HDMIC_4_LHC_CLK_N, port HDMIC_LHC.4_LHC_CLK_N  [project net HDMIC_LHC.4_LHC_CLK_N]
HDMIC_4_LHC_CLK_P: sheet U_FIT_HDMI_X34-28/HDMIC_4_LHC_CLK_P, port HDMIC_LHC.4_LHC_CLK_P  [project net HDMIC_LHC.4_LHC_CLK_P]
HDMIC_5_LHC_CLK_N: sheet U_FIT_HDMI_X34-28/HDMIC_5_LHC_CLK_N, port HDMIC_LHC.5_LHC_CLK_N  [project net HDMIC_LHC.5_LHC_CLK_N]
HDMIC_5_LHC_CLK_P: sheet U_FIT_HDMI_X34-28/HDMIC_5_LHC_CLK_P, port HDMIC_LHC.5_LHC_CLK_P  [project net HDMIC_LHC.5_LHC_CLK_P]
HDMIC_6_LHC_CLK_N: sheet U_FIT_HDMI_X21-17/HDMIC_6_LHC_CLK_N, port HDMIC_LHC.6_LHC_CLK_N  [project net HDMIC_LHC.6_LHC_CLK_N]
HDMIC_6_LHC_CLK_P: sheet U_FIT_HDMI_X21-17/HDMIC_6_LHC_CLK_P, port HDMIC_LHC.6_LHC_CLK_P  [project net HDMIC_LHC.6_LHC_CLK_P]
HDMIC_7_LHC_CLK_N: sheet U_FIT_HDMI_X21-17/HDMIC_7_LHC_CLK_N, port HDMIC_LHC.7_LHC_CLK_N  [project net HDMIC_LHC.7_LHC_CLK_N]
HDMIC_7_LHC_CLK_P: sheet U_FIT_HDMI_X21-17/HDMIC_7_LHC_CLK_P, port HDMIC_LHC.7_LHC_CLK_P  [project net HDMIC_LHC.7_LHC_CLK_P]
HDMIC_8_LHC_CLK_N: sheet U_FIT_HDMI_X25-29/HDMIC_8_LHC_CLK_N, port HDMIC_LHC.8_LHC_CLK_N  [project net HDMIC_LHC.8_LHC_CLK_N]
HDMIC_8_LHC_CLK_P: sheet U_FIT_HDMI_X25-29/HDMIC_8_LHC_CLK_P, port HDMIC_LHC.8_LHC_CLK_P  [project net HDMIC_LHC.8_LHC_CLK_P]
HDMIC_9_LHC_CLK_N: sheet U_FIT_HDMI_X25-29/HDMIC_9_LHC_CLK_N, port HDMIC_LHC.9_LHC_CLK_N  [project net HDMIC_LHC.9_LHC_CLK_N]
HDMIC_9_LHC_CLK_P: sheet U_FIT_HDMI_X25-29/HDMIC_9_LHC_CLK_P, port HDMIC_LHC.9_LHC_CLK_P  [project net HDMIC_LHC.9_LHC_CLK_P]

### Buses and harness runs
bus TCM_SPI_CLKA_[0..9] = port TCM_SPI_CLKA_[0..9]
bus TCM_SPI_CLKC_[0..9] = port TCM_SPI_CLKC_[0..9]
bus TCM_SPI_MISOA_[0..9] = port TCM_SPI_MISOA_[0..9]
bus TCM_SPI_MISOC_[0..9] = port TCM_SPI_MISOC_[0..9]
bus TCM_SPI_MOSIA_[0..9] = port TCM_SPI_MOSIA_[0..9]
bus TCM_SPI_MOSIC_[0..9] = port TCM_SPI_MOSIC_[0..9]
bus TCM_SPI_SELA_[0..9] = port TCM_SPI_SELA_[0..9]
bus TCM_SPI_SELC_[0..9] = port TCM_SPI_SELC_[0..9]
harness port HDMIA0 = sheet U_FIT_HDMI_X31-7/HDMIA0
harness port HDMIA1 = sheet U_FIT_HDMI_X31-7/HDMIA1
harness port HDMIA2 = sheet U_FIT_HDMI_X22-18/HDMIA2
harness port HDMIA3 = sheet U_FIT_HDMI_X22-18/HDMIA3
harness port HDMIA4 = sheet U_FIT_HDMI_X32-26/HDMIA4
harness port HDMIA5 = sheet U_FIT_HDMI_X32-26/HDMIA5
harness port HDMIA6 = sheet U_FIT_HDMI_X19-9/HDMIA6
harness port HDMIA7 = sheet U_FIT_HDMI_X19-9/HDMIA7
harness port HDMIA8 = sheet U_FIT_HDMI_X27-23/HDMIA8
harness port HDMIA9 = sheet U_FIT_HDMI_X27-23/HDMIA9
harness port HDMIC0 = sheet U_FIT_HDMI_X16-33/HDMIC0
harness port HDMIC1 = sheet U_FIT_HDMI_X16-33/HDMIC1
harness port HDMIC2 = sheet U_FIT_HDMI_X24-20/HDMIC2
harness port HDMIC3 = sheet U_FIT_HDMI_X24-20/HDMIC3
harness port HDMIC4 = sheet U_FIT_HDMI_X34-28/HDMIC4
harness port HDMIC5 = sheet U_FIT_HDMI_X34-28/HDMIC5
harness port HDMIC6 = sheet U_FIT_HDMI_X21-17/HDMIC6
harness port HDMIC7 = sheet U_FIT_HDMI_X21-17/HDMIC7
harness port HDMIC8 = sheet U_FIT_HDMI_X25-29/HDMIC8
harness port HDMIC9 = sheet U_FIT_HDMI_X25-29/HDMIC9

### Notes on the sheet
- Project/Equipment
- Document
- Designer
- Drawn by
- Check.by
- Copyright WUT ISE 2024.
  This documentation describes Open Hardware and is licensed under the CERN OHL v.2. You may redistribute and modify this documentation under the terms of the CERN OHL v.2. (http://ohwr.org/CERNOHL). This documentation is distributed WITHOUT ANY EXPRESS OR IMPLIED WARRANTY, INCLUDING OF MERCHANTABILITY, SATISFACTORY QUALITY AND FITNESS FOR A PARTICULAR PURPOSE. Please see the CERN OHL v.2 for applicable conditions.
- Contact
- File
- Last Mod.
- Print Date
- Sheet
- Size
- A3
- of
- Rev